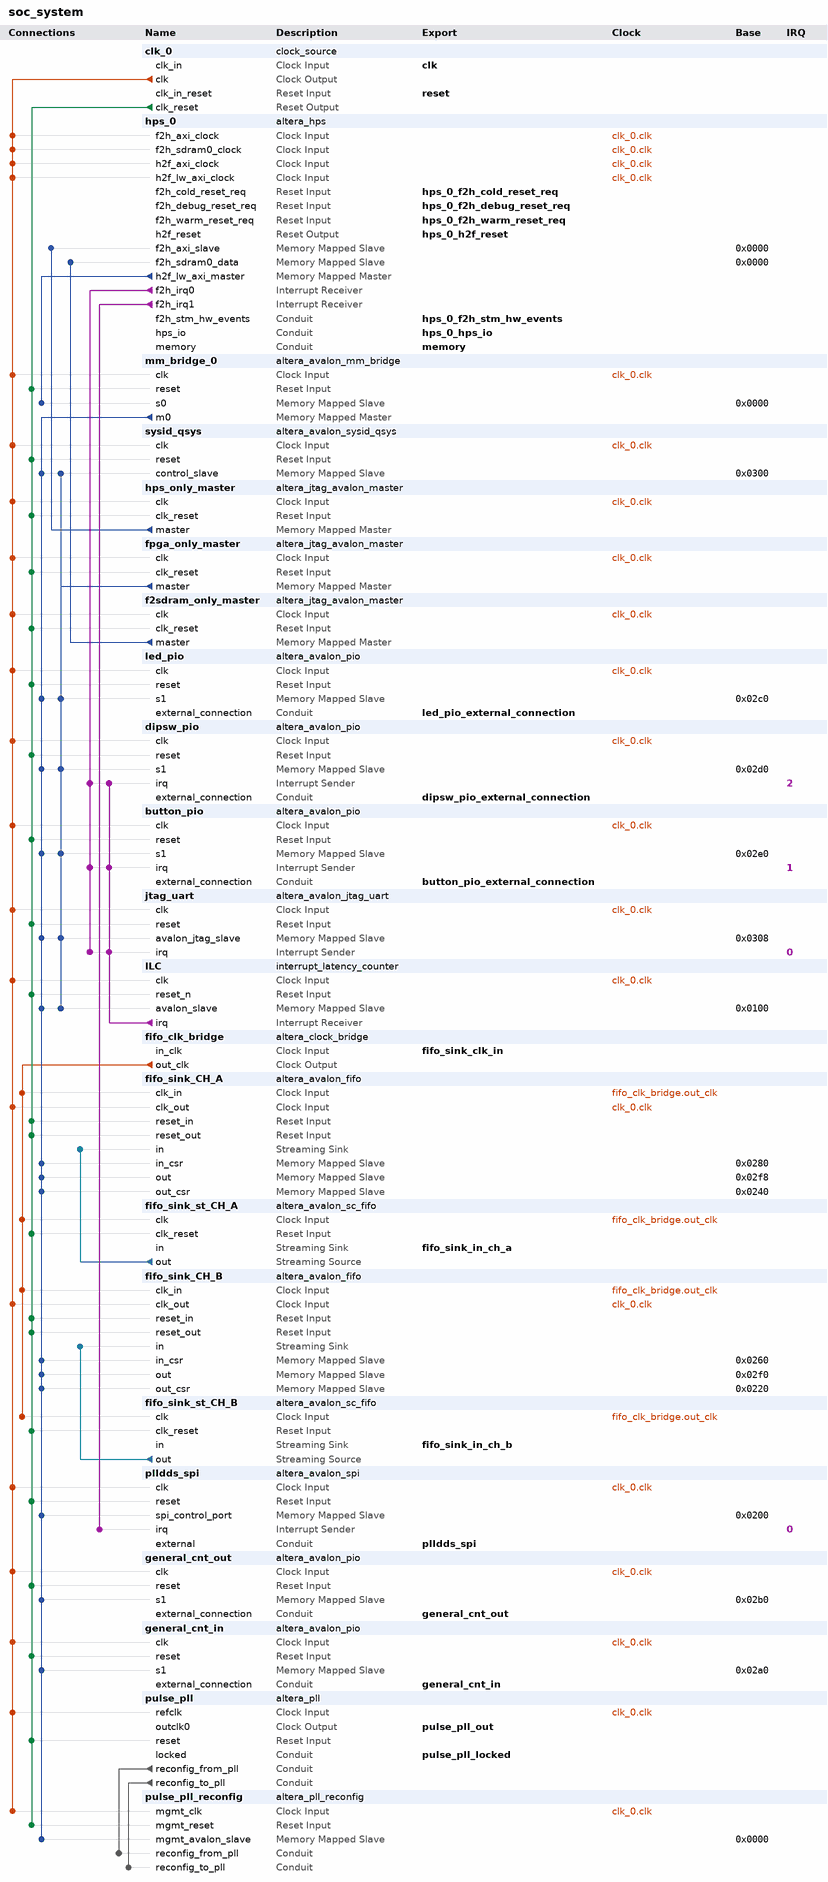
[diagram p0: system contents]
# Platform Designer (Qsys) system soc_system, Cyclone V 5CSXFC6D6F31C6
# Parameters at their usual value, and those the tool derives, are not listed.
package require -exact qsys 17.1
create_system soc_system
set_project_property DEVICE_FAMILY {Cyclone V}
set_project_property DEVICE 5CSXFC6D6F31C6

add_instance clk_0 clock_source 17.1
set_instance_parameter_value clk_0 clockFrequency 50000000

add_instance hps_0 altera_hps 17.1
set_instance_parameter_value hps_0 EMAC1_Mode RGMII
set_instance_parameter_value hps_0 EMAC1_PinMuxing {HPS I/O Set 0}
set_instance_parameter_value hps_0 F2SCLK_COLDRST_Enable true
set_instance_parameter_value hps_0 F2SCLK_DBGRST_Enable true
set_instance_parameter_value hps_0 F2SCLK_WARMRST_Enable true
set_instance_parameter_value hps_0 F2SDRAM_Type {Avalon-MM Bidirectional}
set_instance_parameter_value hps_0 F2SDRAM_Width 256
set_instance_parameter_value hps_0 F2SINTERRUPT_Enable true
set_instance_parameter_value hps_0 F2S_Width 2
set_instance_parameter_value hps_0 FPGA_PERIPHERAL_OUTPUT_CLOCK_FREQ_EMAC0_GTX_CLK 100
set_instance_parameter_value hps_0 FPGA_PERIPHERAL_OUTPUT_CLOCK_FREQ_EMAC0_MD_CLK 100.0
set_instance_parameter_value hps_0 FPGA_PERIPHERAL_OUTPUT_CLOCK_FREQ_EMAC1_GTX_CLK 100
set_instance_parameter_value hps_0 FPGA_PERIPHERAL_OUTPUT_CLOCK_FREQ_EMAC1_MD_CLK 100.0
set_instance_parameter_value hps_0 HPS_PROTOCOL DDR3
set_instance_parameter_value hps_0 I2C0_Mode I2C
set_instance_parameter_value hps_0 I2C0_PinMuxing {HPS I/O Set 0}
set_instance_parameter_value hps_0 I2C1_Mode I2C
set_instance_parameter_value hps_0 I2C1_PinMuxing {HPS I/O Set 0}
set_instance_parameter_value hps_0 LWH2F_Enable true
set_instance_parameter_value hps_0 MEM_BANKADDR_WIDTH 3
set_instance_parameter_value hps_0 MEM_CLK_FREQ 400.0
set_instance_parameter_value hps_0 MEM_COL_ADDR_WIDTH 10
set_instance_parameter_value hps_0 MEM_DQ_WIDTH 32
set_instance_parameter_value hps_0 MEM_DRV_STR RZQ/6
set_instance_parameter_value hps_0 MEM_ROW_ADDR_WIDTH 15
set_instance_parameter_value hps_0 MEM_RTT_NOM RZQ/6
set_instance_parameter_value hps_0 MEM_RTT_WR {Dynamic ODT off}
set_instance_parameter_value hps_0 MEM_TCL 11
set_instance_parameter_value hps_0 MEM_TFAW_NS 45.0
set_instance_parameter_value hps_0 MEM_TRAS_NS 35.0
set_instance_parameter_value hps_0 MEM_TRCD_NS 13.75
set_instance_parameter_value hps_0 MEM_TRFC_NS 260.0
set_instance_parameter_value hps_0 MEM_TRP_NS 13.75
set_instance_parameter_value hps_0 MEM_VENDOR Micron
set_instance_parameter_value hps_0 MEM_WTCL 7
set_instance_parameter_value hps_0 QSPI_Mode {1 SS}
set_instance_parameter_value hps_0 QSPI_PinMuxing {HPS I/O Set 0}
set_instance_parameter_value hps_0 REF_CLK_FREQ 25.0
set_instance_parameter_value hps_0 S2FCLK_USER2CLK 5
set_instance_parameter_value hps_0 S2F_Width 2
set_instance_parameter_value hps_0 SDIO_Mode {4-bit Data}
set_instance_parameter_value hps_0 SDIO_PinMuxing {HPS I/O Set 0}
set_instance_parameter_value hps_0 SPIM0_Mode {Single Slave Select}
set_instance_parameter_value hps_0 SPIM0_PinMuxing {HPS I/O Set 0}
set_instance_parameter_value hps_0 SPIM1_Mode {Single Slave Select}
set_instance_parameter_value hps_0 SPIM1_PinMuxing {HPS I/O Set 0}
set_instance_parameter_value hps_0 STM_Enable true
set_instance_parameter_value hps_0 TIMING_BOARD_AC_SKEW 0.02
set_instance_parameter_value hps_0 TIMING_BOARD_AC_TO_CK_SKEW 0.01
set_instance_parameter_value hps_0 TIMING_BOARD_DQ_TO_DQS_SKEW 0.05
set_instance_parameter_value hps_0 TIMING_BOARD_MAX_CK_DELAY 0.03
set_instance_parameter_value hps_0 TIMING_BOARD_MAX_DQS_DELAY 0.02
set_instance_parameter_value hps_0 TIMING_BOARD_SKEW_BETWEEN_DQS 0.06
set_instance_parameter_value hps_0 TIMING_BOARD_SKEW_CKDQS_DIMM_MAX 0.12
set_instance_parameter_value hps_0 TIMING_BOARD_SKEW_CKDQS_DIMM_MIN 0.06
set_instance_parameter_value hps_0 TIMING_BOARD_SKEW_WITHIN_DQS 0.01
set_instance_parameter_value hps_0 TIMING_TDH 65
set_instance_parameter_value hps_0 TIMING_TDQSCK 255
set_instance_parameter_value hps_0 TIMING_TDQSQ 125
set_instance_parameter_value hps_0 TIMING_TDS 30
set_instance_parameter_value hps_0 TIMING_TIH 140
set_instance_parameter_value hps_0 TIMING_TIS 190
set_instance_parameter_value hps_0 TIMING_TQSH 0.4
set_instance_parameter_value hps_0 UART0_Mode {No Flow Control}
set_instance_parameter_value hps_0 UART0_PinMuxing {HPS I/O Set 0}
set_instance_parameter_value hps_0 USB1_Mode SDR
set_instance_parameter_value hps_0 USB1_PinMuxing {HPS I/O Set 0}
set_instance_parameter_value hps_0 desired_cfg_clk_mhz 100.0
set_instance_parameter_value hps_0 desired_qspi_clk_mhz 400.0

add_instance mm_bridge_0 altera_avalon_mm_bridge 17.1
set_instance_parameter_value mm_bridge_0 ADDRESS_UNITS SYMBOLS
set_instance_parameter_value mm_bridge_0 ADDRESS_WIDTH 10
set_instance_parameter_value mm_bridge_0 DATA_WIDTH 32
set_instance_parameter_value mm_bridge_0 MAX_PENDING_RESPONSES 4
set_instance_parameter_value mm_bridge_0 USE_AUTO_ADDRESS_WIDTH 1

add_instance sysid_qsys altera_avalon_sysid_qsys 17.1
set_instance_parameter_value sysid_qsys id -1395322110

add_instance hps_only_master altera_jtag_avalon_master 17.1

add_instance fpga_only_master altera_jtag_avalon_master 17.1

add_instance f2sdram_only_master altera_jtag_avalon_master 17.1

add_instance led_pio altera_avalon_pio 17.1
set_instance_parameter_value led_pio direction Output
set_instance_parameter_value led_pio width 10

add_instance dipsw_pio altera_avalon_pio 17.1
set_instance_parameter_value dipsw_pio bitClearingEdgeCapReg true
set_instance_parameter_value dipsw_pio captureEdge true
set_instance_parameter_value dipsw_pio direction Input
set_instance_parameter_value dipsw_pio edgeType ANY
set_instance_parameter_value dipsw_pio generateIRQ true
set_instance_parameter_value dipsw_pio irqType EDGE
set_instance_parameter_value dipsw_pio width 10

add_instance button_pio altera_avalon_pio 17.1
set_instance_parameter_value button_pio bitClearingEdgeCapReg true
set_instance_parameter_value button_pio captureEdge true
set_instance_parameter_value button_pio direction Input
set_instance_parameter_value button_pio edgeType FALLING
set_instance_parameter_value button_pio generateIRQ true
set_instance_parameter_value button_pio irqType EDGE
set_instance_parameter_value button_pio width 4

add_instance jtag_uart altera_avalon_jtag_uart 17.1
set_instance_parameter_value jtag_uart allowMultipleConnections true
set_instance_parameter_value jtag_uart simInteractiveOptions INTERACTIVE_ASCII_OUTPUT

add_instance ILC interrupt_latency_counter 17.1

add_instance fifo_clk_bridge altera_clock_bridge 17.1
set_instance_parameter_value fifo_clk_bridge DERIVED_CLOCK_RATE 0
set_instance_parameter_value fifo_clk_bridge EXPLICIT_CLOCK_RATE 0

add_instance fifo_sink_CH_A altera_avalon_fifo 17.1
set_instance_parameter_value fifo_sink_CH_A bitsPerSymbol 16
set_instance_parameter_value fifo_sink_CH_A channelWidth 0
set_instance_parameter_value fifo_sink_CH_A errorWidth 0
set_instance_parameter_value fifo_sink_CH_A fifoDepth 4096
set_instance_parameter_value fifo_sink_CH_A fifoInputInterfaceOptions AVALONST_SINK
set_instance_parameter_value fifo_sink_CH_A fifoOutputInterfaceOptions AVALONMM_READ
set_instance_parameter_value fifo_sink_CH_A singleClockMode false
set_instance_parameter_value fifo_sink_CH_A symbolsPerBeat 2
set_instance_parameter_value fifo_sink_CH_A useIRQ false
set_instance_parameter_value fifo_sink_CH_A usePacket false
set_instance_parameter_value fifo_sink_CH_A useReadControl true

add_instance fifo_sink_st_CH_A altera_avalon_sc_fifo 17.1
set_instance_parameter_value fifo_sink_st_CH_A BITS_PER_SYMBOL 16
set_instance_parameter_value fifo_sink_st_CH_A CHANNEL_WIDTH 0
set_instance_parameter_value fifo_sink_st_CH_A ERROR_WIDTH 0
set_instance_parameter_value fifo_sink_st_CH_A FIFO_DEPTH 16
set_instance_parameter_value fifo_sink_st_CH_A USE_FILL_LEVEL 0
set_instance_parameter_value fifo_sink_st_CH_A USE_MEMORY_BLOCKS 1
set_instance_parameter_value fifo_sink_st_CH_A USE_STORE_FORWARD 0

add_instance fifo_sink_CH_B altera_avalon_fifo 17.1
set_instance_parameter_value fifo_sink_CH_B bitsPerSymbol 16
set_instance_parameter_value fifo_sink_CH_B channelWidth 0
set_instance_parameter_value fifo_sink_CH_B errorWidth 0
set_instance_parameter_value fifo_sink_CH_B fifoDepth 4096
set_instance_parameter_value fifo_sink_CH_B fifoInputInterfaceOptions AVALONST_SINK
set_instance_parameter_value fifo_sink_CH_B fifoOutputInterfaceOptions AVALONMM_READ
set_instance_parameter_value fifo_sink_CH_B singleClockMode false
set_instance_parameter_value fifo_sink_CH_B symbolsPerBeat 2
set_instance_parameter_value fifo_sink_CH_B useIRQ false
set_instance_parameter_value fifo_sink_CH_B usePacket false
set_instance_parameter_value fifo_sink_CH_B useReadControl true

add_instance fifo_sink_st_CH_B altera_avalon_sc_fifo 17.1
set_instance_parameter_value fifo_sink_st_CH_B BITS_PER_SYMBOL 16
set_instance_parameter_value fifo_sink_st_CH_B CHANNEL_WIDTH 0
set_instance_parameter_value fifo_sink_st_CH_B ERROR_WIDTH 0
set_instance_parameter_value fifo_sink_st_CH_B FIFO_DEPTH 16
set_instance_parameter_value fifo_sink_st_CH_B USE_FILL_LEVEL 0
set_instance_parameter_value fifo_sink_st_CH_B USE_MEMORY_BLOCKS 1
set_instance_parameter_value fifo_sink_st_CH_B USE_STORE_FORWARD 0

add_instance plldds_spi altera_avalon_spi 17.1
set_instance_parameter_value plldds_spi clockPolarity 0
set_instance_parameter_value plldds_spi dataWidth 24
set_instance_parameter_value plldds_spi masterSPI true
set_instance_parameter_value plldds_spi numberOfSlaves 1
set_instance_parameter_value plldds_spi targetClockRate 4200000
set_instance_parameter_value plldds_spi targetSlaveSelectToSClkDelay 2000.0

add_instance general_cnt_out altera_avalon_pio 17.1
set_instance_parameter_value general_cnt_out direction Output
set_instance_parameter_value general_cnt_out width 32

add_instance general_cnt_in altera_avalon_pio 17.1
set_instance_parameter_value general_cnt_in direction Input
set_instance_parameter_value general_cnt_in width 32

add_instance pulse_pll altera_pll 17.1
set_instance_parameter_value pulse_pll gui_device_speed_grade 1
set_instance_parameter_value pulse_pll gui_en_reconf true
set_instance_parameter_value pulse_pll gui_number_of_clocks 1
set_instance_parameter_value pulse_pll gui_operation_mode direct
set_instance_parameter_value pulse_pll gui_output_clock_frequency0 4.0
set_instance_parameter_value pulse_pll gui_pll_mode {Fractional-N PLL}
set_instance_parameter_value pulse_pll gui_reference_clock_frequency 50.0
set_instance_parameter_value pulse_pll gui_use_locked true

add_instance pulse_pll_reconfig altera_pll_reconfig 17.1

# connections
add_connection clk_0.clk button_pio.clk clock
add_connection clk_0.clk dipsw_pio.clk clock
add_connection clk_0.clk f2sdram_only_master.clk clock
add_connection clk_0.clk fifo_sink_CH_A.clk_out clock
add_connection clk_0.clk fifo_sink_CH_B.clk_out clock
add_connection clk_0.clk fpga_only_master.clk clock
add_connection clk_0.clk general_cnt_in.clk clock
add_connection clk_0.clk general_cnt_out.clk clock
add_connection clk_0.clk hps_0.f2h_axi_clock clock
add_connection clk_0.clk hps_0.f2h_sdram0_clock clock
add_connection clk_0.clk hps_0.h2f_axi_clock clock
add_connection clk_0.clk hps_0.h2f_lw_axi_clock clock
add_connection clk_0.clk hps_only_master.clk clock
add_connection clk_0.clk ILC.clk clock
add_connection clk_0.clk jtag_uart.clk clock
add_connection clk_0.clk led_pio.clk clock
add_connection clk_0.clk mm_bridge_0.clk clock
add_connection clk_0.clk plldds_spi.clk clock
add_connection clk_0.clk pulse_pll.refclk clock
add_connection clk_0.clk pulse_pll_reconfig.mgmt_clk clock
add_connection clk_0.clk sysid_qsys.clk clock
add_connection fifo_clk_bridge.out_clk fifo_sink_CH_A.clk_in clock
add_connection fifo_clk_bridge.out_clk fifo_sink_CH_B.clk_in clock
add_connection fifo_clk_bridge.out_clk fifo_sink_st_CH_A.clk clock
add_connection fifo_clk_bridge.out_clk fifo_sink_st_CH_B.clk clock
add_connection clk_0.clk_reset button_pio.reset reset
add_connection clk_0.clk_reset dipsw_pio.reset reset
add_connection clk_0.clk_reset f2sdram_only_master.clk_reset reset
add_connection clk_0.clk_reset fifo_sink_CH_A.reset_in reset
add_connection clk_0.clk_reset fifo_sink_CH_A.reset_out reset
add_connection clk_0.clk_reset fifo_sink_CH_B.reset_in reset
add_connection clk_0.clk_reset fifo_sink_CH_B.reset_out reset
add_connection clk_0.clk_reset fifo_sink_st_CH_A.clk_reset reset
add_connection clk_0.clk_reset fifo_sink_st_CH_B.clk_reset reset
add_connection clk_0.clk_reset fpga_only_master.clk_reset reset
add_connection clk_0.clk_reset general_cnt_in.reset reset
add_connection clk_0.clk_reset general_cnt_out.reset reset
add_connection clk_0.clk_reset hps_only_master.clk_reset reset
add_connection clk_0.clk_reset ILC.reset_n reset
add_connection clk_0.clk_reset jtag_uart.reset reset
add_connection clk_0.clk_reset led_pio.reset reset
add_connection clk_0.clk_reset mm_bridge_0.reset reset
add_connection clk_0.clk_reset plldds_spi.reset reset
add_connection clk_0.clk_reset pulse_pll.reset reset
add_connection clk_0.clk_reset pulse_pll_reconfig.mgmt_reset reset
add_connection clk_0.clk_reset sysid_qsys.reset reset
add_connection f2sdram_only_master.master hps_0.f2h_sdram0_data avalon
set_connection_parameter_value f2sdram_only_master.master/hps_0.f2h_sdram0_data baseAddress 0x0000
add_connection fpga_only_master.master button_pio.s1 avalon
set_connection_parameter_value fpga_only_master.master/button_pio.s1 baseAddress 0x02e0
add_connection fpga_only_master.master dipsw_pio.s1 avalon
set_connection_parameter_value fpga_only_master.master/dipsw_pio.s1 baseAddress 0x02d0
add_connection fpga_only_master.master ILC.avalon_slave avalon
set_connection_parameter_value fpga_only_master.master/ILC.avalon_slave baseAddress 0x0100
add_connection fpga_only_master.master jtag_uart.avalon_jtag_slave avalon
set_connection_parameter_value fpga_only_master.master/jtag_uart.avalon_jtag_slave baseAddress 0x0308
add_connection fpga_only_master.master led_pio.s1 avalon
set_connection_parameter_value fpga_only_master.master/led_pio.s1 baseAddress 0x02c0
add_connection fpga_only_master.master sysid_qsys.control_slave avalon
set_connection_parameter_value fpga_only_master.master/sysid_qsys.control_slave baseAddress 0x0300
add_connection hps_0.h2f_lw_axi_master mm_bridge_0.s0 avalon
set_connection_parameter_value hps_0.h2f_lw_axi_master/mm_bridge_0.s0 baseAddress 0x0000
add_connection hps_only_master.master hps_0.f2h_axi_slave avalon
set_connection_parameter_value hps_only_master.master/hps_0.f2h_axi_slave baseAddress 0x0000
add_connection mm_bridge_0.m0 button_pio.s1 avalon
set_connection_parameter_value mm_bridge_0.m0/button_pio.s1 baseAddress 0x02e0
add_connection mm_bridge_0.m0 dipsw_pio.s1 avalon
set_connection_parameter_value mm_bridge_0.m0/dipsw_pio.s1 baseAddress 0x02d0
add_connection mm_bridge_0.m0 fifo_sink_CH_A.in_csr avalon
set_connection_parameter_value mm_bridge_0.m0/fifo_sink_CH_A.in_csr baseAddress 0x0280
add_connection mm_bridge_0.m0 fifo_sink_CH_A.out avalon
set_connection_parameter_value mm_bridge_0.m0/fifo_sink_CH_A.out baseAddress 0x02f8
add_connection mm_bridge_0.m0 fifo_sink_CH_A.out_csr avalon
set_connection_parameter_value mm_bridge_0.m0/fifo_sink_CH_A.out_csr baseAddress 0x0240
add_connection mm_bridge_0.m0 fifo_sink_CH_B.in_csr avalon
set_connection_parameter_value mm_bridge_0.m0/fifo_sink_CH_B.in_csr baseAddress 0x0260
add_connection mm_bridge_0.m0 fifo_sink_CH_B.out avalon
set_connection_parameter_value mm_bridge_0.m0/fifo_sink_CH_B.out baseAddress 0x02f0
add_connection mm_bridge_0.m0 fifo_sink_CH_B.out_csr avalon
set_connection_parameter_value mm_bridge_0.m0/fifo_sink_CH_B.out_csr baseAddress 0x0220
add_connection mm_bridge_0.m0 general_cnt_in.s1 avalon
set_connection_parameter_value mm_bridge_0.m0/general_cnt_in.s1 baseAddress 0x02a0
add_connection mm_bridge_0.m0 general_cnt_out.s1 avalon
set_connection_parameter_value mm_bridge_0.m0/general_cnt_out.s1 baseAddress 0x02b0
add_connection mm_bridge_0.m0 ILC.avalon_slave avalon
set_connection_parameter_value mm_bridge_0.m0/ILC.avalon_slave baseAddress 0x0100
add_connection mm_bridge_0.m0 jtag_uart.avalon_jtag_slave avalon
set_connection_parameter_value mm_bridge_0.m0/jtag_uart.avalon_jtag_slave baseAddress 0x0308
add_connection mm_bridge_0.m0 led_pio.s1 avalon
set_connection_parameter_value mm_bridge_0.m0/led_pio.s1 baseAddress 0x02c0
add_connection mm_bridge_0.m0 plldds_spi.spi_control_port avalon
set_connection_parameter_value mm_bridge_0.m0/plldds_spi.spi_control_port baseAddress 0x0200
add_connection mm_bridge_0.m0 pulse_pll_reconfig.mgmt_avalon_slave avalon
set_connection_parameter_value mm_bridge_0.m0/pulse_pll_reconfig.mgmt_avalon_slave baseAddress 0x0000
add_connection mm_bridge_0.m0 sysid_qsys.control_slave avalon
set_connection_parameter_value mm_bridge_0.m0/sysid_qsys.control_slave baseAddress 0x0300
add_connection fifo_sink_st_CH_A.out fifo_sink_CH_A.in avalon_streaming
add_connection fifo_sink_st_CH_B.out fifo_sink_CH_B.in avalon_streaming
add_connection pulse_pll.reconfig_from_pll pulse_pll_reconfig.reconfig_from_pll conduit
add_connection pulse_pll.reconfig_to_pll pulse_pll_reconfig.reconfig_to_pll conduit
add_connection hps_0.f2h_irq0 button_pio.irq interrupt
set_connection_parameter_value hps_0.f2h_irq0/button_pio.irq irqNumber 1
add_connection hps_0.f2h_irq0 dipsw_pio.irq interrupt
set_connection_parameter_value hps_0.f2h_irq0/dipsw_pio.irq irqNumber 0
add_connection hps_0.f2h_irq0 jtag_uart.irq interrupt
set_connection_parameter_value hps_0.f2h_irq0/jtag_uart.irq irqNumber 2
add_connection hps_0.f2h_irq1 plldds_spi.irq interrupt
set_connection_parameter_value hps_0.f2h_irq1/plldds_spi.irq irqNumber 0
add_connection ILC.irq button_pio.irq interrupt
set_connection_parameter_value ILC.irq/button_pio.irq irqNumber 1
add_connection ILC.irq dipsw_pio.irq interrupt
set_connection_parameter_value ILC.irq/dipsw_pio.irq irqNumber 2
add_connection ILC.irq jtag_uart.irq interrupt
set_connection_parameter_value ILC.irq/jtag_uart.irq irqNumber 0

# exported interfaces
add_interface button_pio_external_connection conduit end
set_interface_property button_pio_external_connection EXPORT_OF button_pio.external_connection
add_interface clk clock sink
set_interface_property clk EXPORT_OF clk_0.clk_in
add_interface dipsw_pio_external_connection conduit end
set_interface_property dipsw_pio_external_connection EXPORT_OF dipsw_pio.external_connection
add_interface fifo_sink_clk_in clock sink
set_interface_property fifo_sink_clk_in EXPORT_OF fifo_clk_bridge.in_clk
add_interface fifo_sink_in_ch_a avalon_streaming sink
set_interface_property fifo_sink_in_ch_a EXPORT_OF fifo_sink_st_CH_A.in
add_interface fifo_sink_in_ch_b avalon_streaming sink
set_interface_property fifo_sink_in_ch_b EXPORT_OF fifo_sink_st_CH_B.in
add_interface general_cnt_in conduit end
set_interface_property general_cnt_in EXPORT_OF general_cnt_in.external_connection
add_interface general_cnt_out conduit end
set_interface_property general_cnt_out EXPORT_OF general_cnt_out.external_connection
add_interface hps_0_f2h_cold_reset_req reset sink
set_interface_property hps_0_f2h_cold_reset_req EXPORT_OF hps_0.f2h_cold_reset_req
add_interface hps_0_f2h_debug_reset_req reset sink
set_interface_property hps_0_f2h_debug_reset_req EXPORT_OF hps_0.f2h_debug_reset_req
add_interface hps_0_f2h_stm_hw_events conduit end
set_interface_property hps_0_f2h_stm_hw_events EXPORT_OF hps_0.f2h_stm_hw_events
add_interface hps_0_f2h_warm_reset_req reset sink
set_interface_property hps_0_f2h_warm_reset_req EXPORT_OF hps_0.f2h_warm_reset_req
add_interface hps_0_h2f_reset reset source
set_interface_property hps_0_h2f_reset EXPORT_OF hps_0.h2f_reset
add_interface hps_0_hps_io conduit end
set_interface_property hps_0_hps_io EXPORT_OF hps_0.hps_io
add_interface led_pio_external_connection conduit end
set_interface_property led_pio_external_connection EXPORT_OF led_pio.external_connection
add_interface memory conduit end
set_interface_property memory EXPORT_OF hps_0.memory
add_interface plldds_spi conduit end
set_interface_property plldds_spi EXPORT_OF plldds_spi.external
add_interface pulse_pll_locked conduit end
set_interface_property pulse_pll_locked EXPORT_OF pulse_pll.locked
add_interface pulse_pll_out clock source
set_interface_property pulse_pll_out EXPORT_OF pulse_pll.outclk0
add_interface reset reset sink
set_interface_property reset EXPORT_OF clk_0.clk_in_reset

set_interconnect_requirement {$system} qsys_mm.clockCrossingAdapter HANDSHAKE
set_interconnect_requirement {$system} qsys_mm.maxAdditionalLatency 1

save_system soc_system.qsys
